# EAGLE design RGB_7-segment_breakout (EAGLE 6.5.0)
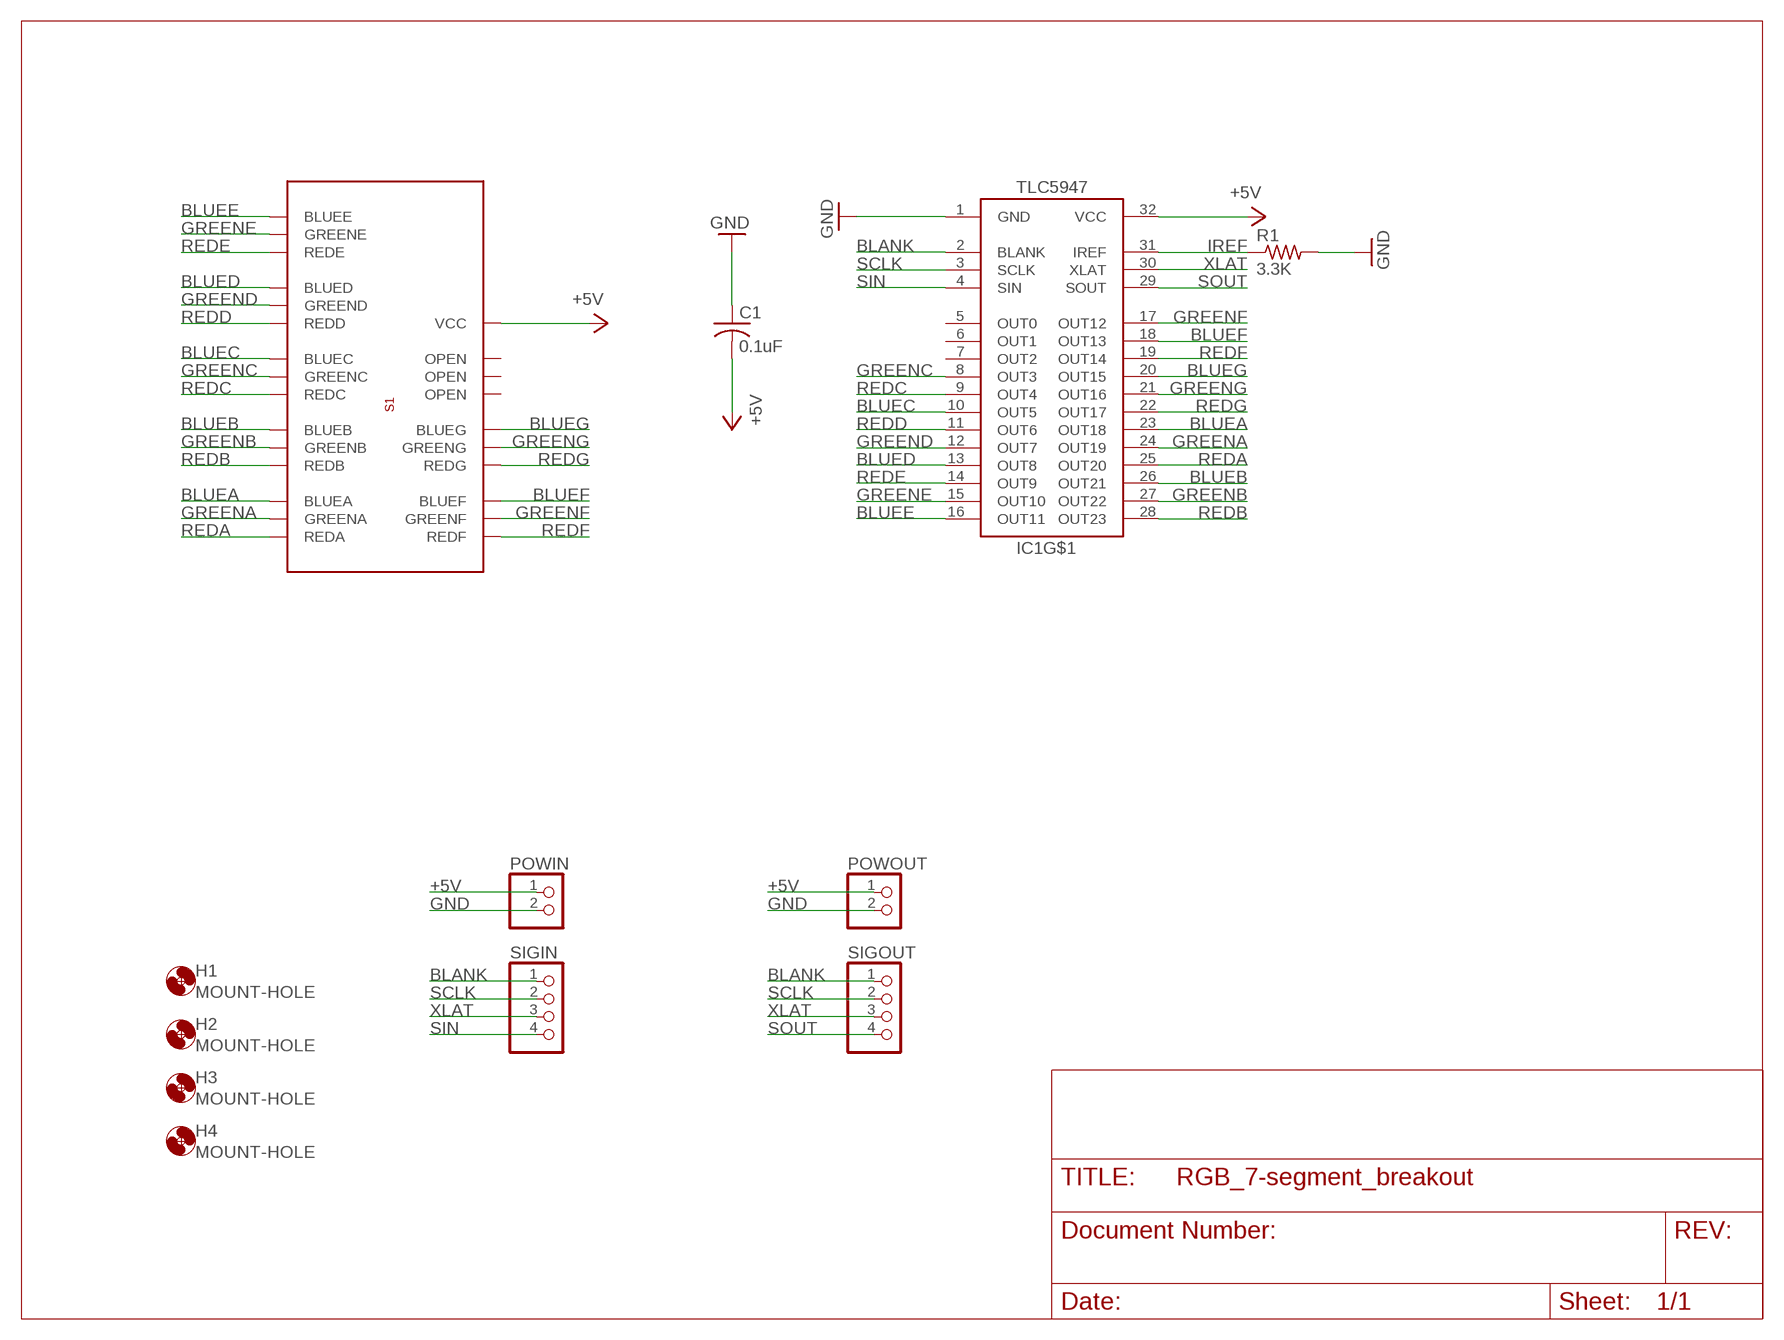
[diagram p0: schematic, sheet 1]

## Parts
C1  0.1uF  C-US025-025X050  [C025-025X050]
H1  MOUNT-HOLE  [2,1]
H2  MOUNT-HOLE  [2,1]
H3  MOUNT-HOLE  [2,1]
H4  MOUNT-HOLE  [2,1]
IC1  TLC5947-DAP  [HTSSOP32DAP]
POWIN  PINHD-1X2  [1X02]
POWOUT  PINHD-1X2  [1X02]
R1  3.3K  R-US_0207/10  [0207/10]
S1  AD-121F2  [AD-121F2]
SIGIN  PINHD-1X4  [1X04]
SIGOUT  PINHD-1X4  [1X04]

## Nets
+5V: C1.2 IC1.32(VCC) POWIN.1 POWOUT.1 S1.P$17(VCC)
BLANK: IC1.2(BLANK) SIGIN.1 SIGOUT.1
BLUEA: IC1.23(OUT18) S1.P$21(BLUEA)
BLUEB: IC1.26(OUT21) S1.P$24(BLUEB)
BLUEC: IC1.10(OUT5) S1.P$5(BLUEC)
BLUED: IC1.13(OUT8) S1.P$2(BLUED)
BLUEE: IC1.16(OUT11) S1.P$9(BLUEE)
BLUEF: IC1.18(OUT13) S1.P$18(BLUEF)
BLUEG: IC1.20(OUT15) S1.P$19(BLUEG)
GND: C1.1 IC1.1(GND) POWIN.2 POWOUT.2 R1.2
GREENA: IC1.24(OUT19) S1.P$22(GREENA)
GREENB: IC1.27(OUT22) S1.P$16(GREENB)
GREENC: IC1.8(OUT3) S1.P$11(GREENC)
GREEND: IC1.12(OUT7) S1.P$3(GREEND)
GREENE: IC1.15(OUT10) S1.P$1(GREENE)
GREENF: IC1.17(OUT12) S1.P$13(GREENF)
GREENG: IC1.21(OUT16) S1.P$15(GREENG)
IREF: IC1.31(IREF) R1.1
REDA: IC1.25(OUT20) S1.P$23(REDA)
REDB: IC1.28(OUT23) S1.P$25(REDB)
REDC: IC1.9(OUT4) S1.P$6(REDC)
REDD: IC1.11(OUT6) S1.P$4(REDD)
REDE: IC1.14(OUT9) S1.P$10(REDE)
REDF: IC1.19(OUT14) S1.P$14(REDF)
REDG: IC1.22(OUT17) S1.P$20(REDG)
SCLK: IC1.3(SCLK) SIGIN.2 SIGOUT.2
SIN: IC1.4(SIN) SIGIN.4
SOUT: IC1.29(SOUT) SIGOUT.4
XLAT: IC1.30(XLAT) SIGIN.3 SIGOUT.3
Unconnected: IC1.5(OUT0) IC1.6(OUT1) IC1.7(OUT2) IC1.EXP(PAD) S1.P$7(OPEN) S1.P$8(OPEN) S1.P$12(OPEN)

## Library data of the parts
C1 = adafruit:C-US: CAPACITOR, American symbol
H1-H4 = yorgo:MOUNT-HOLE: MOUNTING HOLE with drill center marker
IC1 = adafruit:TLC5947
POWIN POWOUT = pinhead:PINHD-1X2: PIN HEADER
R1 = adafruit:R-US_: RESISTOR, American symbol
S1 = yorgo:AD-121F2
SIGIN SIGOUT = pinhead:PINHD-1X4: PIN HEADER

## Board
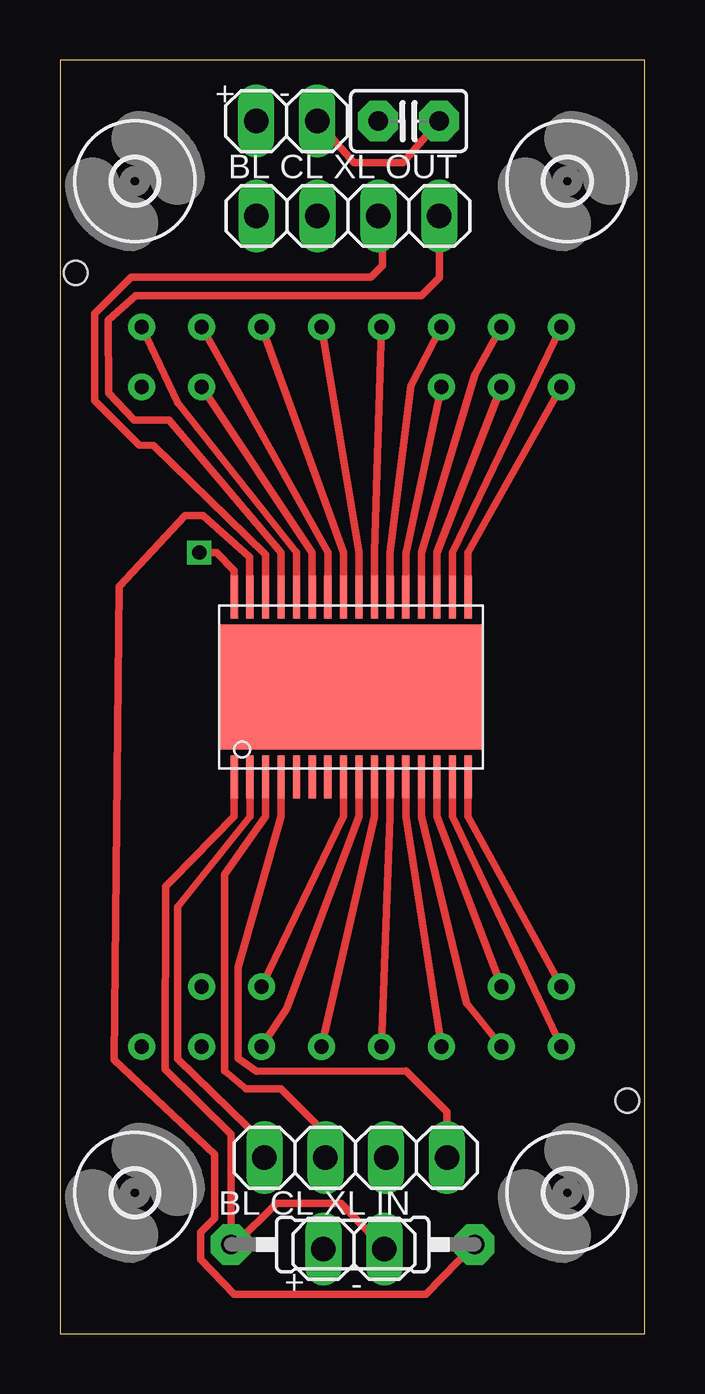
[diagram p1: board, top side]
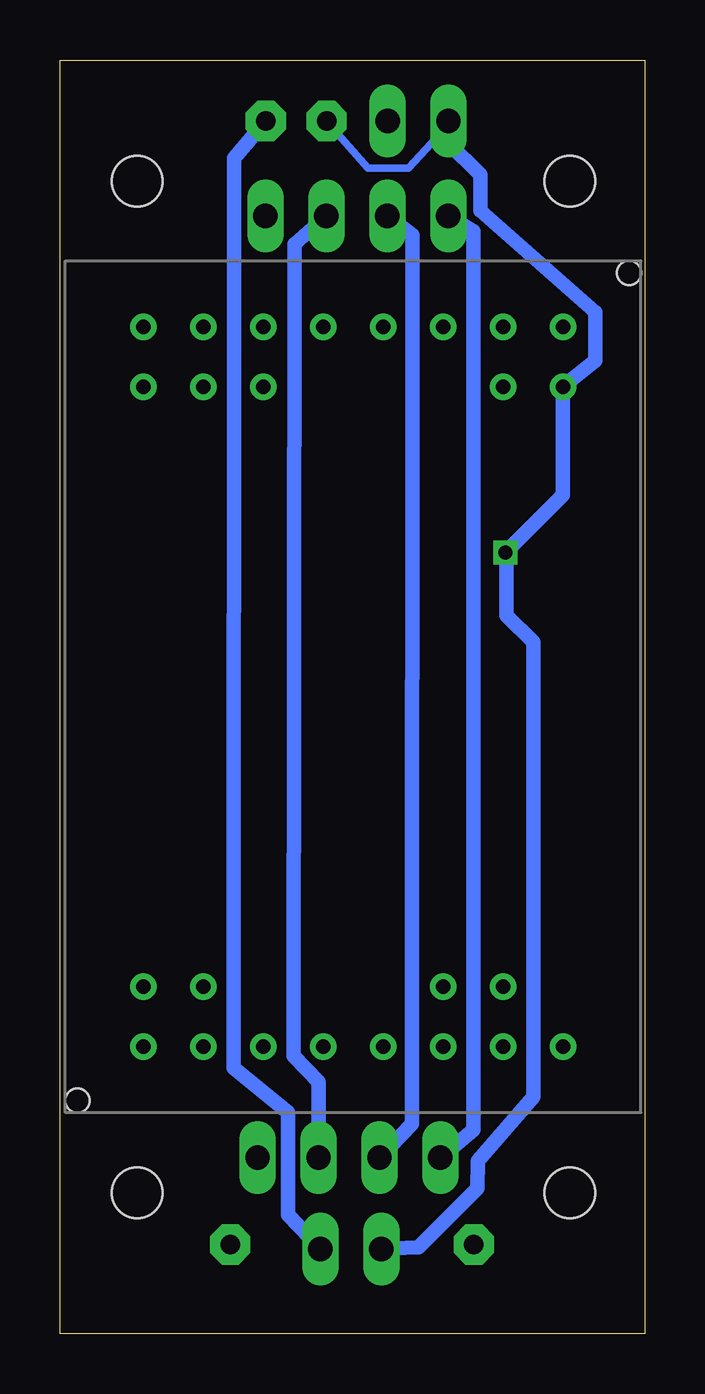
[diagram p2: board, bottom side, seen from below]

Size 24.38 x 53.09 mm. Coordinates in mm from the lower left corner, seen from the top.
Outline: 0,0 24.38,0 24.38,53.09 0,53.09 0,0
Copper layers (1*16): Top 0.035mm / dielectric 1.5mm / Bottom 0.035mm
Design rules "default *": minimum track width 10mil, minimum drill 0.5mm, track to track 8mil, track to pad 8mil, pad to pad 8mil, via to via 8mil, smd to smd 8mil, copper to edge 40mil, drill to drill 8mil, minimum pad ring 10mil, minimum via ring 8mil, stop-mask expansion 4mil, vias tented up to drill 0mil, thermal gap 10mil

### Footprints (pad centres in the part's own frame; a part is rotated, then mirrored left to right if it is on the bottom)
C025-025X050 = drill 0.813 pad 1.676 octagon: 1 -1.27,0; 2 1.27,0
2,1 = hole 2.1: 0,0
HTSSOP32DAP = smd 0.3 x 1.8: 1 -4.875,-3.75; 2 -4.225,-3.75; 3 -3.575,-3.75; 4 -2.925,-3.75; 5 -2.275,-3.75; 6 -1.625,-3.75; 7 -0.975,-3.75; 8 -0.325,-3.75; 9 0.325,-3.75; 10 0.975,-3.75; 11 1.625,-3.75; 12 2.275,-3.75; 13 2.925,-3.75; 14 3.575,-3.75; 15 4.225,-3.75; 16 4.875,-3.75; 17 4.875,3.75; 18 4.225,3.75; 19 3.575,3.75; 20 2.925,3.75; 21 2.275,3.75; 22 1.625,3.75; 23 0.975,3.75; 24 0.325,3.75; 25 -0.325,3.75; 26 -0.975,3.75; 27 -1.625,3.75; 28 -2.275,3.75; 29 -2.925,3.75; 30 -3.575,3.75; 31 -4.225,3.75; 32 -4.875,3.75 | smd 11 x 5.2: EXP 0,0
1X02 = drill 1.016 long: 1 -1.27,0; 2 1.27,0
0207/10 = drill 0.813 pad 1.676 octagon: 1 -5.08,0; 2 5.08,0
AD-121F2 = drill 0.6: P$1 3.302,2.794; P$2 5.802,2.794; P$3 8.302,2.794; P$4 10.802,2.794; P$5 13.302,2.794; P$6 15.802,2.794; P$7 18.302,2.794; P$8 20.802,2.794; P$9 3.302,5.294; P$10 5.802,5.294; P$11 15.802,5.294; P$12 18.302,5.294; P$13 3.302,30.294; P$14 5.802,30.294; P$15 8.302,30.294; P$16 18.302,30.294; P$17 20.802,30.294; P$18 3.302,32.794; P$19 5.802,32.794; P$20 8.302,32.794; P$21 10.802,32.794; P$22 13.302,32.794; P$23 15.802,32.794; P$24 18.302,32.794; P$25 20.802,32.794 | hole 1: 0.552,0.544; 23.552,35.044
1X04 = drill 1.016 long: 1 -3.81,0; 2 -1.27,0; 3 1.27,0; 4 3.81,0

### Placement (x,y rotation side)
C1  14.54,50.54 180 top
H1  21.16,48.04 0 top
H2  21.16,5.87 0 top
H3  3.13,48.04 0 top
H4  3.13,5.87 0 top
IC1  12.14,26.95 0 top
POWIN  12.25,3.53 0 top
POWOUT  9.46,50.54 0 top
R1  12.21,3.71 180 top
S1  24.21,9.17 0 bottom
SIGIN  12.33,7.33 0 top
SIGOUT  12.01,46.59 0 top

### Tracks (layer width: path | path; a pad name or v marks a point on that pad's centre or on a via)
+5V  (via drill 0.6)
  Top 0.305: v5.81,32.56 v5.81,32.55 6.53,32.55 7.27,31.81 IC1.32
  Bottom 0.305: C1.2 11.55,48.58 9.85,48.58 8.19,50.39 POWOUT.1
  Bottom 0.406: 8.21,49.64 POWOUT.1
  Bottom 0.61: 8.21,49.64 6.86,48.3 6.86,46.8 2.05,42.58 2.07,40.55 S1.P$17 3.4,34.96 v5.81,32.55 5.76,32.51 5.76,29.93 4.65,28.82 4.65,9.88 6.96,7.2 6.99,6.05 9.45,3.59 POWIN.1
BLANK
  Top 0.305: IC1.2 7.92,21.55 4.92,17.79 4.92,11.45 8.52,7.93 SIGIN.1
  Bottom 0.61: SIGOUT.1 7.14,45.95 7.14,8.48 SIGIN.1
BLUEA
  Top 0.305: IC1.23 13.12,32.55 S1.P$21
BLUEB
  Top 0.305: IC1.26 11.17,32.55 S1.P$24
BLUEC
  Top 0.305: IC1.10 13.12,21.55 S1.P$5
BLUED
  Top 0.305: IC1.13 15.07,21.55 16.95,13.78 S1.P$2
BLUEE
  Top 0.305: IC1.16 17.02,21.55 S1.P$9
BLUEF
  Top 0.305: IC1.18 16.37,32.55 S1.P$18
BLUEG
  Top 0.305: IC1.20 15.07,32.55 17.29,39.97 S1.P$19
GND
  Top 0.305: IC1.1 7.27,21.55 4.67,18.9 4.4,18.64 4.38,11.02 7.13,8.3 R1.2 7.31,3.71 9.03,5.44 11.73,5.44 POWIN.2 | POWOUT.2 12.27,48.8 14.3,48.8 C1.1
  Bottom 0.61: POWIN.2 14.87,4.94 14.87,9.22 17.14,11.08 17.12,49 C1.1
GREENA
  Top 0.305: IC1.24 12.47,32.55 S1.P$22
GREENB
  Top 0.305: IC1.27 10.52,32.55 S1.P$16
GREENC
  Top 0.305: IC1.8 11.82,21.55 S1.P$11
GREEND
  Top 0.305: IC1.12 14.42,21.55 S1.P$3
GREENE
  Top 0.305: IC1.15 16.37,21.55 S1.P$1
GREENF
  Top 0.305: IC1.17 17.02,32.55 S1.P$13
GREENG
  Top 0.305: IC1.21 14.42,32.51 | 14.42,32.51 14.42,32.55 | S1.P$15 14.42,32.51
IREF
  Top 0.305: IC1.31 7.91,32.37 5.97,34.1 5.23,34.1 2.47,31.13 2.25,11.42 6.45,7.48 6.45,4.8 5.87,4.22 5.87,3.1 7.25,1.65 15.26,1.65 R1.1
REDA
  Top 0.305: IC1.25 11.82,32.55 S1.P$23
REDB
  Top 0.305: IC1.28 9.87,32.55 4.92,38.8 S1.P$25
REDC
  Top 0.305: IC1.9 12.47,21.55 9.44,13.54 S1.P$6
REDD
  Top 0.305: IC1.11 13.77,21.55 S1.P$4
REDE
  Top 0.305: IC1.14 15.72,21.55 S1.P$10
REDF
  Top 0.305: IC1.19 15.72,32.55 S1.P$14
REDG
  Top 0.305: IC1.22 13.77,32.55 14.64,39.52 S1.P$20
SCLK
  Top 0.305: IC1.3 8.57,21.55 6.86,19.13 6.87,10.95 7.76,10.19 9.22,10.19 11.06,8.35 SIGIN.2
  Bottom 0.61: SIGOUT.2 9.69,45.79 9.71,8.75 SIGIN.2
SIN
  Top 0.305: IC1.4 9.22,21.55 7.43,15.27 7.43,11.46 8.2,10.92 14.43,10.95 16.14,9.24 SIGIN.4
SOUT
  Top 0.305: IC1.29 9.22,32.55 4.54,38.07 3.1,38.07 2.04,39.19 2.02,42.24 3.16,43.27 15.08,43.27 15.82,44.01 15.82,46.76 SIGOUT.4
XLAT
  Top 0.305: IC1.30 8.57,32.48 3.91,37.02 3.31,37.04 1.46,38.88 1.46,42.52 2.98,44.04 12.96,44.04 13.44,44.52 13.44,46.61 SIGOUT.3
  Bottom 0.61: SIGIN.3 13.6,10.49 14.65,11.57 14.6,45.41 SIGOUT.3

### Text on the board
tNames: + | - | BL CL XL OUT | BL CL XL IN | + | -